# Altium schematic sheet FPGA-IO-BANKS.SchDoc
size A4; SheetNumber: 6; SheetTotal: 6
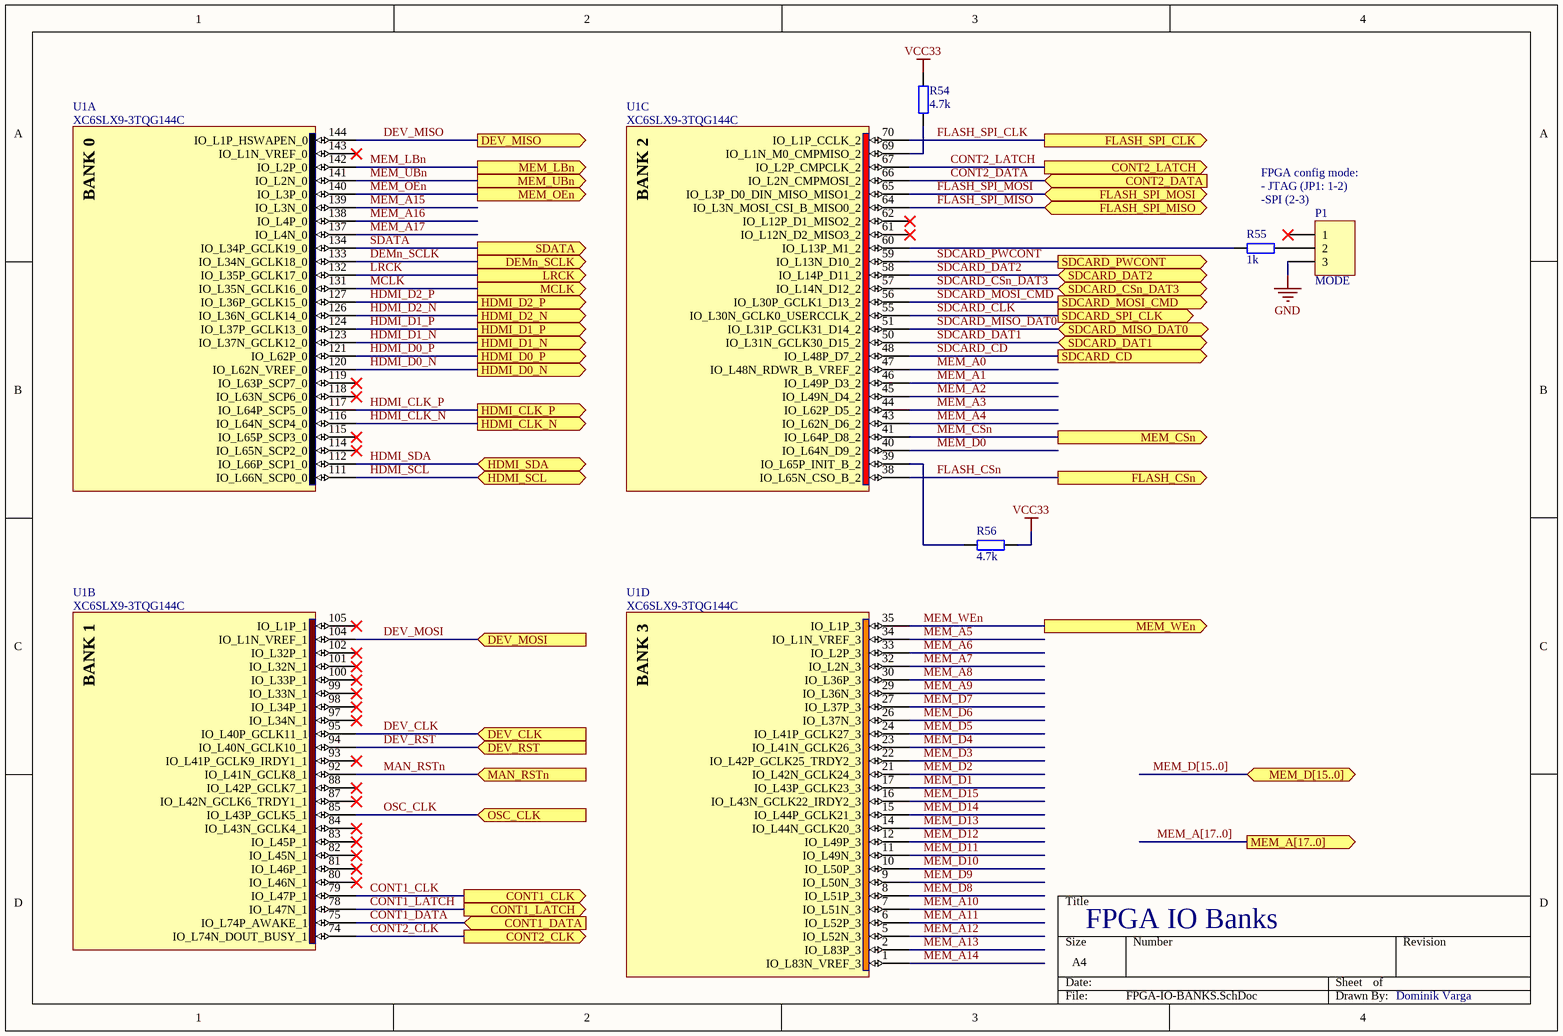
[diagram p0: FPGA-IO-BANKS.SchDoc]

## Parts
P1  MODE  [HDR1X3]
R54  4.7k  [RES_SMD0603]
R55  1k  [RES_SMD0603]
R56  4.7k  [RES_SMD0603]
U1  XC6SLX9-3TQG144C  [QFP50P2200X2200X160-144N]  (parts A,B,C,D of 7)

## Ports
CONT1_CLK (out, see Connectors-DAC-Controllers[3B]), CONT1_DATA (in, see Connectors-DAC-Controllers[3B]), CONT1_LATCH (out, see Connectors-DAC-Controllers[3B]), CONT2_CLK (out, see Connectors-DAC-Controllers[3C]), CONT2_DATA (in, see Connectors-DAC-Controllers[3C]), CONT2_LATCH (out, see Connectors-DAC-Controllers[3C]), DEMn_SCLK (out, see Connectors-DAC-Controllers[1B]), DEV_CLK (in, see FPGA-OSC-JTAG[3D]), DEV_MISO (out, see FPGA-OSC-JTAG[1D]), DEV_MOSI (in, see FPGA-OSC-JTAG[3D]), DEV_RST (in, see FPGA-OSC-JTAG[1D]), FLASH_CSn (out, see SRAM-SPI-FLASH[1D]), FLASH_SPI_CLK (out, see SRAM-SPI-FLASH[1D]), FLASH_SPI_MISO (bidir, see SRAM-SPI-FLASH[1D]), FLASH_SPI_MOSI (bidir, see SRAM-SPI-FLASH[1D]), HDMI_CLK_N (out, see Connectors-HDMI-MicroSD[2A]), HDMI_CLK_P (out, see Connectors-HDMI-MicroSD[2A]), HDMI_D0_N (out, see Connectors-HDMI-MicroSD[2A]), HDMI_D0_P (out, see Connectors-HDMI-MicroSD[2A]), HDMI_D1_N (out, see Connectors-HDMI-MicroSD[2A]), HDMI_D1_P (out, see Connectors-HDMI-MicroSD[2A]), HDMI_D2_N (out, see Connectors-HDMI-MicroSD[2A]), HDMI_D2_P (out, see Connectors-HDMI-MicroSD[2A]), HDMI_SCL (bidir, see Connectors-HDMI-MicroSD[3B]), HDMI_SDA (bidir, see Connectors-HDMI-MicroSD[3B]), LRCK (out, see Connectors-DAC-Controllers[1B]), MAN_RSTn (in, see FPGA-OSC-JTAG[3C]), MCLK (out, see Connectors-DAC-Controllers[1B]), MEM_A[17..0] (out, see SRAM-SPI-FLASH[3A]), MEM_CSn (out, see SRAM-SPI-FLASH[1C]), MEM_D[15..0] (bidir, see SRAM-SPI-FLASH[1A]), MEM_LBn (out, see SRAM-SPI-FLASH[1C]), MEM_OEn (out, see SRAM-SPI-FLASH[1C]), MEM_UBn (out, see SRAM-SPI-FLASH[1C]), MEM_WEn (out, see SRAM-SPI-FLASH[1C]), OSC_CLK (in, see FPGA-OSC-JTAG[3B]), SDATA (out, see Connectors-DAC-Controllers[1B]), SDCARD_CD (out, see Connectors-HDMI-MicroSD[3D]), SDCARD_CSn_DAT3 (bidir, see Connectors-HDMI-MicroSD[3C]), SDCARD_DAT1 (bidir, see Connectors-HDMI-MicroSD[3D]), SDCARD_DAT2 (bidir, see Connectors-HDMI-MicroSD[3D]), SDCARD_MISO_DAT0 (bidir, see Connectors-HDMI-MicroSD[3D]), SDCARD_MOSI_CMD (out, see Connectors-HDMI-MicroSD[3D]), SDCARD_PWCONT (out, see Connectors-HDMI-MicroSD[2C]), SDCARD_SPI_CLK (out, see Connectors-HDMI-MicroSD[3D])

## Nets
GND: P1.3
VCC33: R54.1 R56.1
CONT1_CLK: U1.79(IO_L47P_1) ; port CONT1_CLK
CONT1_DATA: U1.75(IO_L74P_AWAKE_1) ; port CONT1_DATA
CONT1_LATCH: U1.78(IO_L47N_1) ; port CONT1_LATCH
CONT2_CLK: U1.74(IO_L74N_DOUT_BUSY_1) ; port CONT2_CLK
CONT2_DATA: U1.66(IO_L2N_CMPMOSI_2) ; port CONT2_DATA
CONT2_LATCH: U1.67(IO_L2P_CMPCLK_2) ; port CONT2_LATCH
DEMn_SCLK: U1.133(IO_L34N_GCLK18_0) ; port DEMn_SCLK
DEV_CLK: U1.95(IO_L40P_GCLK11_1) ; port DEV_CLK
DEV_MISO: U1.144(IO_L1P_HSWAPEN_0) ; port DEV_MISO
DEV_MOSI: U1.104(IO_L1N_VREF_1) ; port DEV_MOSI
DEV_RST: U1.94(IO_L40N_GCLK10_1) ; port DEV_RST
FLASH_CSn: U1.38(IO_L65N_CSO_B_2) ; port FLASH_CSn
FLASH_SPI_CLK: U1.70(IO_L1P_CCLK_2) ; port FLASH_SPI_CLK
FLASH_SPI_MISO: U1.64(IO_L3N_MOSI_CSI_B_MISO0_2) ; port FLASH_SPI_MISO
FLASH_SPI_MOSI: U1.65(IO_L3P_D0_DIN_MISO_MISO1_2) ; port FLASH_SPI_MOSI
HDMI_CLK_N: U1.116(IO_L64N_SCP4_0) ; port HDMI_CLK_N
HDMI_CLK_P: U1.117(IO_L64P_SCP5_0) ; port HDMI_CLK_P
HDMI_D0_N: U1.120(IO_L62N_VREF_0) ; port HDMI_D0_N
HDMI_D0_P: U1.121(IO_L62P_0) ; port HDMI_D0_P
HDMI_D1_N: U1.123(IO_L37N_GCLK12_0) ; port HDMI_D1_N
HDMI_D1_P: U1.124(IO_L37P_GCLK13_0) ; port HDMI_D1_P
HDMI_D2_N: U1.126(IO_L36N_GCLK14_0) ; port HDMI_D2_N
HDMI_D2_P: U1.127(IO_L36P_GCLK15_0) ; port HDMI_D2_P
HDMI_SCL: U1.111(IO_L66N_SCP0_0) ; port HDMI_SCL
HDMI_SDA: U1.112(IO_L66P_SCP1_0) ; port HDMI_SDA
LRCK: U1.132(IO_L35P_GCLK17_0) ; port LRCK
MAN_RSTn: U1.92(IO_L41N_GCLK8_1) ; port MAN_RSTn
MCLK: U1.131(IO_L35N_GCLK16_0) ; port MCLK
MEM_A0: U1.47(IO_L48N_RDWR_B_VREF_2)
MEM_A1: U1.46(IO_L49P_D3_2)
MEM_A2: U1.45(IO_L49N_D4_2)
MEM_A3: U1.44(IO_L62P_D5_2)
MEM_A4: U1.43(IO_L62N_D6_2)
MEM_A5: U1.34(IO_L1N_VREF_3)
MEM_A6: U1.33(IO_L2P_3)
MEM_A7: U1.32(IO_L2N_3)
MEM_A8: U1.30(IO_L36P_3)
MEM_A9: U1.29(IO_L36N_3)
MEM_A10: U1.7(IO_L51N_3)
MEM_A11: U1.6(IO_L52P_3)
MEM_A12: U1.5(IO_L52N_3)
MEM_A13: U1.2(IO_L83P_3)
MEM_A14: U1.1(IO_L83N_VREF_3)
MEM_A15: U1.139(IO_L3N_0)
MEM_A16: U1.138(IO_L4P_0)
MEM_A17: U1.137(IO_L4N_0)
MEM_CSn: U1.41(IO_L64P_D8_2) ; port MEM_CSn
MEM_D0: U1.40(IO_L64N_D9_2)
MEM_D1: U1.17(IO_L43P_GCLK23_3)
MEM_D2: U1.21(IO_L42N_GCLK24_3)
MEM_D3: U1.22(IO_L42P_GCLK25_TRDY2_3)
MEM_D4: U1.23(IO_L41N_GCLK26_3)
MEM_D5: U1.24(IO_L41P_GCLK27_3)
MEM_D6: U1.26(IO_L37N_3)
MEM_D7: U1.27(IO_L37P_3)
MEM_D8: U1.8(IO_L51P_3)
MEM_D9: U1.9(IO_L50N_3)
MEM_D10: U1.10(IO_L50P_3)
MEM_D11: U1.11(IO_L49N_3)
MEM_D12: U1.12(IO_L49P_3)
MEM_D13: U1.14(IO_L44N_GCLK20_3)
MEM_D14: U1.15(IO_L44P_GCLK21_3)
MEM_D15: U1.16(IO_L43N_GCLK22_IRDY2_3)
MEM_LBn: U1.142(IO_L2P_0) ; port MEM_LBn
MEM_OEn: U1.140(IO_L3P_0) ; port MEM_OEn
MEM_UBn: U1.141(IO_L2N_0) ; port MEM_UBn
MEM_WEn: U1.35(IO_L1P_3) ; port MEM_WEn
OSC_CLK: U1.85(IO_L43P_GCLK5_1) ; port OSC_CLK
SDATA: U1.134(IO_L34P_GCLK19_0) ; port SDATA
SDCARD_CD: U1.48(IO_L48P_D7_2) ; port SDCARD_CD
SDCARD_CLK: U1.55(IO_L30N_GCLK0_USERCCLK_2) ; port SDCARD_SPI_CLK
SDCARD_CSn_DAT3: U1.57(IO_L14N_D12_2) ; port SDCARD_CSn_DAT3
SDCARD_DAT1: U1.50(IO_L31N_GCLK30_D15_2) ; port SDCARD_DAT1
SDCARD_DAT2: U1.58(IO_L14P_D11_2) ; port SDCARD_DAT2
SDCARD_MISO_DAT0: U1.51(IO_L31P_GCLK31_D14_2) ; port SDCARD_MISO_DAT0
SDCARD_MOSI_CMD: U1.56(IO_L30P_GCLK1_D13_2) ; port SDCARD_MOSI_CMD
SDCARD_PWCONT: U1.59(IO_L13N_D10_2) ; port SDCARD_PWCONT
NetP1_2: P1.2 R55.1
NetR54_2: R54.2 U1.69(IO_L1N_M0_CMPMISO_2)
NetR55_2: R55.2 U1.60(IO_L13P_M1_2)
NetR56_2: R56.2 U1.39(IO_L65P_INIT_B_2)

Not connected (* = marked no-connect by the designer): P1 1*; U1 61(IO_L12N_D2_MISO3_2)* 62(IO_L12P_D1_MISO2_2)* 80(IO_L46N_1)* 81(IO_L46P_1)* 82(IO_L45N_1)* 83(IO_L45P_1)* 84(IO_L43N_GCLK4_1)* 87(IO_L42N_GCLK6_TRDY1_1)* 88(IO_L42P_GCLK7_1)* 93(IO_L41P_GCLK9_IRDY1_1)* 97(IO_L34N_1)* 98(IO_L34P_1)* 99(IO_L33N_1)* 100(IO_L33P_1)* 101(IO_L32N_1)* 102(IO_L32P_1)* 105(IO_L1P_1)* 114(IO_L65N_SCP2_0)* 115(IO_L65P_SCP3_0)* 118(IO_L63N_SCP6_0)* 119(IO_L63P_SCP7_0)* 143(IO_L1N_VREF_0)*

## Buses and harness runs
bus MEM_A[17..0] = port MEM_A[17..0]
bus MEM_D[15..0] = port MEM_D[15..0]

## Notes on the sheet
- FPGA config mode:
- - JTAG (JP1: 1-2)
- -SPI (2-3)
- FPGA IO Banks
- Dominik Varga
- (in symbol XC6SLX9-3TQG144C, part A) BANK 0
- (in symbol XC6SLX9-3TQG144C, part B) BANK 1
- (in symbol XC6SLX9-3TQG144C, part C) BANK 2
- (in symbol XC6SLX9-3TQG144C, part D) BANK 3

## Library data of the parts
P1 = Header 3: Header, 3-Pin; LatestRevisionDate: 17-Jul-2002; LatestRevisionNote: Re-released for DXP Platform.; Publisher: Altium Limited
R54-R56 = RES_0603: Resistor SMD 0603
U1 = XC6SLX9-3TQG144C: Spartan-6 LX 1.2V FPGA, 102 User I/Os, 144-Pin TQFP (0.5mm Pitch), Speed Grade 3, Industrial Grade, Pb-Free